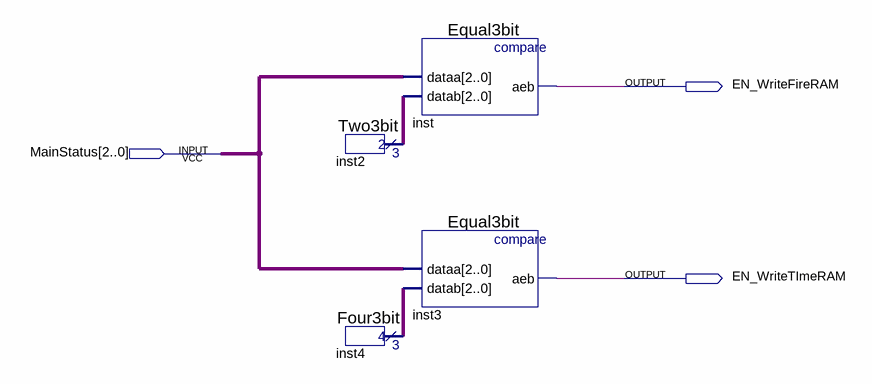
[diagram p0: schematic sheet]
// Quartus schematic PrefabRAM_EN.bdf as structural Verilog: 4 symbols, 3 pins
module PrefabRAM_EN (
  input  [2:0] MainStatus,
  output EN_WriteFireRAM,
  output EN_WriteTImeRAM
);

  wire [2:0] inst2_result, inst4_result;

  Two3bit inst2 (.result(inst2_result));
  Four3bit inst4 (.result(inst4_result));
  Equal3bit inst (.dataa(MainStatus), .datab(inst2_result), .aeb(EN_WriteFireRAM));
  Equal3bit inst3 (.dataa(MainStatus), .datab(inst4_result), .aeb(EN_WriteTImeRAM));
endmodule
